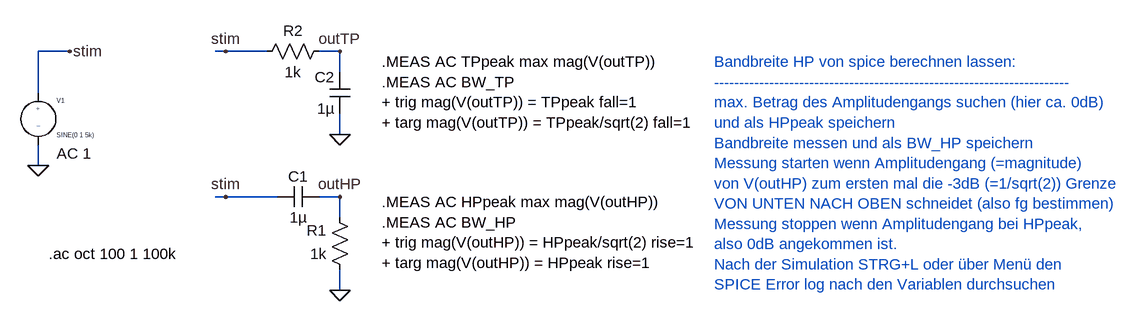
[diagram p0: schematic measure_ac_param.asc]
measure_ac_param.asc, the LTspice schematic file:
Version 4
SHEET 1 880 680
WIRE -1232 -272 -1280 -272
WIRE -992 -272 -1008 -272
WIRE -928 -272 -992 -272
WIRE -816 -272 -848 -272
WIRE -816 -240 -816 -272
WIRE -1280 -208 -1280 -272
WIRE -816 -144 -816 -176
WIRE -1280 -96 -1280 -128
WIRE -992 -48 -1008 -48
WIRE -912 -48 -992 -48
WIRE -816 -48 -848 -48
WIRE -816 -16 -816 -48
WIRE -816 96 -816 64
FLAG -816 96 0
FLAG -992 -48 stim
FLAG -816 -48 outHP
FLAG -816 -144 0
FLAG -992 -272 stim
FLAG -816 -272 outTP
FLAG -1280 -96 0
FLAG -1232 -272 stim
SYMBOL res -800 80 R180
WINDOW 0 36 76 Left 2
WINDOW 3 36 40 Left 2
SYMATTR InstName R1
SYMATTR Value 1k
SYMBOL cap -848 -64 R90
WINDOW 0 0 32 VBottom 2
WINDOW 3 32 32 VTop 2
SYMATTR InstName C1
SYMATTR Value 1µ
SYMBOL res -944 -256 R270
WINDOW 0 32 56 VTop 2
WINDOW 3 0 56 VBottom 2
SYMATTR InstName R2
SYMATTR Value 1k
SYMBOL cap -800 -176 R180
WINDOW 0 24 56 Left 2
WINDOW 3 24 8 Left 2
SYMATTR InstName C2
SYMATTR Value 1µ
SYMBOL source-V -1280 -224 R0
WINDOW 123 28 109 Left 2
WINDOW 39 0 0 Left 2
SYMATTR Value2 AC 1
SYMATTR InstName V1
SYMATTR Value SINE(0 1 5k)
TEXT -752 -40 Left 2 !.MEAS AC HPpeak max mag(V(outHP))\n.MEAS AC BW_HP\n+ trig mag(V(outHP)) = HPpeak/sqrt(2) rise=1\n+ targ mag(V(outHP)) = HPpeak rise=1
TEXT -752 -256 Left 2 !.MEAS AC TPpeak max mag(V(outTP))\n.MEAS AC BW_TP \n+ trig mag(V(outTP)) = TPpeak fall=1\n+ targ mag(V(outTP)) = TPpeak/sqrt(2) fall=1
TEXT -240 -256 Left 2 ;Bandbreite HP von spice berechnen lassen:\n-----------------------------------------------------------------------\nmax. Betrag des Amplitudengangs suchen (hier ca. 0dB) \nund als HPpeak speichern\nBandbreite messen und als BW_HP speichern\nMessung starten wenn Amplitudengang (=magnitude) \nvon V(outHP) zum ersten mal die -3dB (=1/sqrt(2)) Grenze \nVON UNTEN NACH OBEN schneidet (also fg bestimmen)\nMessung stoppen wenn Amplitudengang bei HPpeak, \nalso 0dB angekommen ist.\nNach der Simulation STRG+L oder über Menü den \nSPICE Error log nach den Variablen durchsuchen
TEXT -1264 40 Left 2 !.ac oct 100 1 100k

The netlist it stands for:
* measure_ac_param.asc
R1 0 outHP 1k
C1 outHP stim 1µ
R2 stim outTP 1k
C2 0 outTP 1µ
V1 stim 0 SINE(0 1 5k) AC 1
.MEAS AC HPpeak max mag(V(outHP))
.MEAS AC BW_HP
+ trig mag(V(outHP)) = HPpeak/sqrt(2) rise=1
+ targ mag(V(outHP)) = HPpeak rise=1
.MEAS AC TPpeak max mag(V(outTP))
.MEAS AC BW_TP
+ trig mag(V(outTP)) = TPpeak fall=1
+ targ mag(V(outTP)) = TPpeak/sqrt(2) fall=1
* Bandbreite HP von spice berechnen lassen:
* -----------------------------------------------------------------------
* max. Betrag des Amplitudengangs suchen (hier ca. 0dB)
* und als HPpeak speichern
* Bandbreite messen und als BW_HP speichern
* Messung starten wenn Amplitudengang (=magnitude)
* von V(outHP) zum ersten mal die -3dB (=1/sqrt(2)) Grenze
* VON UNTEN NACH OBEN schneidet (also fg bestimmen)
* Messung stoppen wenn Amplitudengang bei HPpeak,
* also 0dB angekommen ist.
* Nach der Simulation STRG+L oder über Menü den
* SPICE Error log nach den Variablen durchsuchen
.ac oct 100 1 100k
.backanno
.end